# EAGLE schematic hackeeg-connector-24 (EAGLE 9.4.0)

## Sheet 1 of 3: HACKEEG 24 Position Connector Board
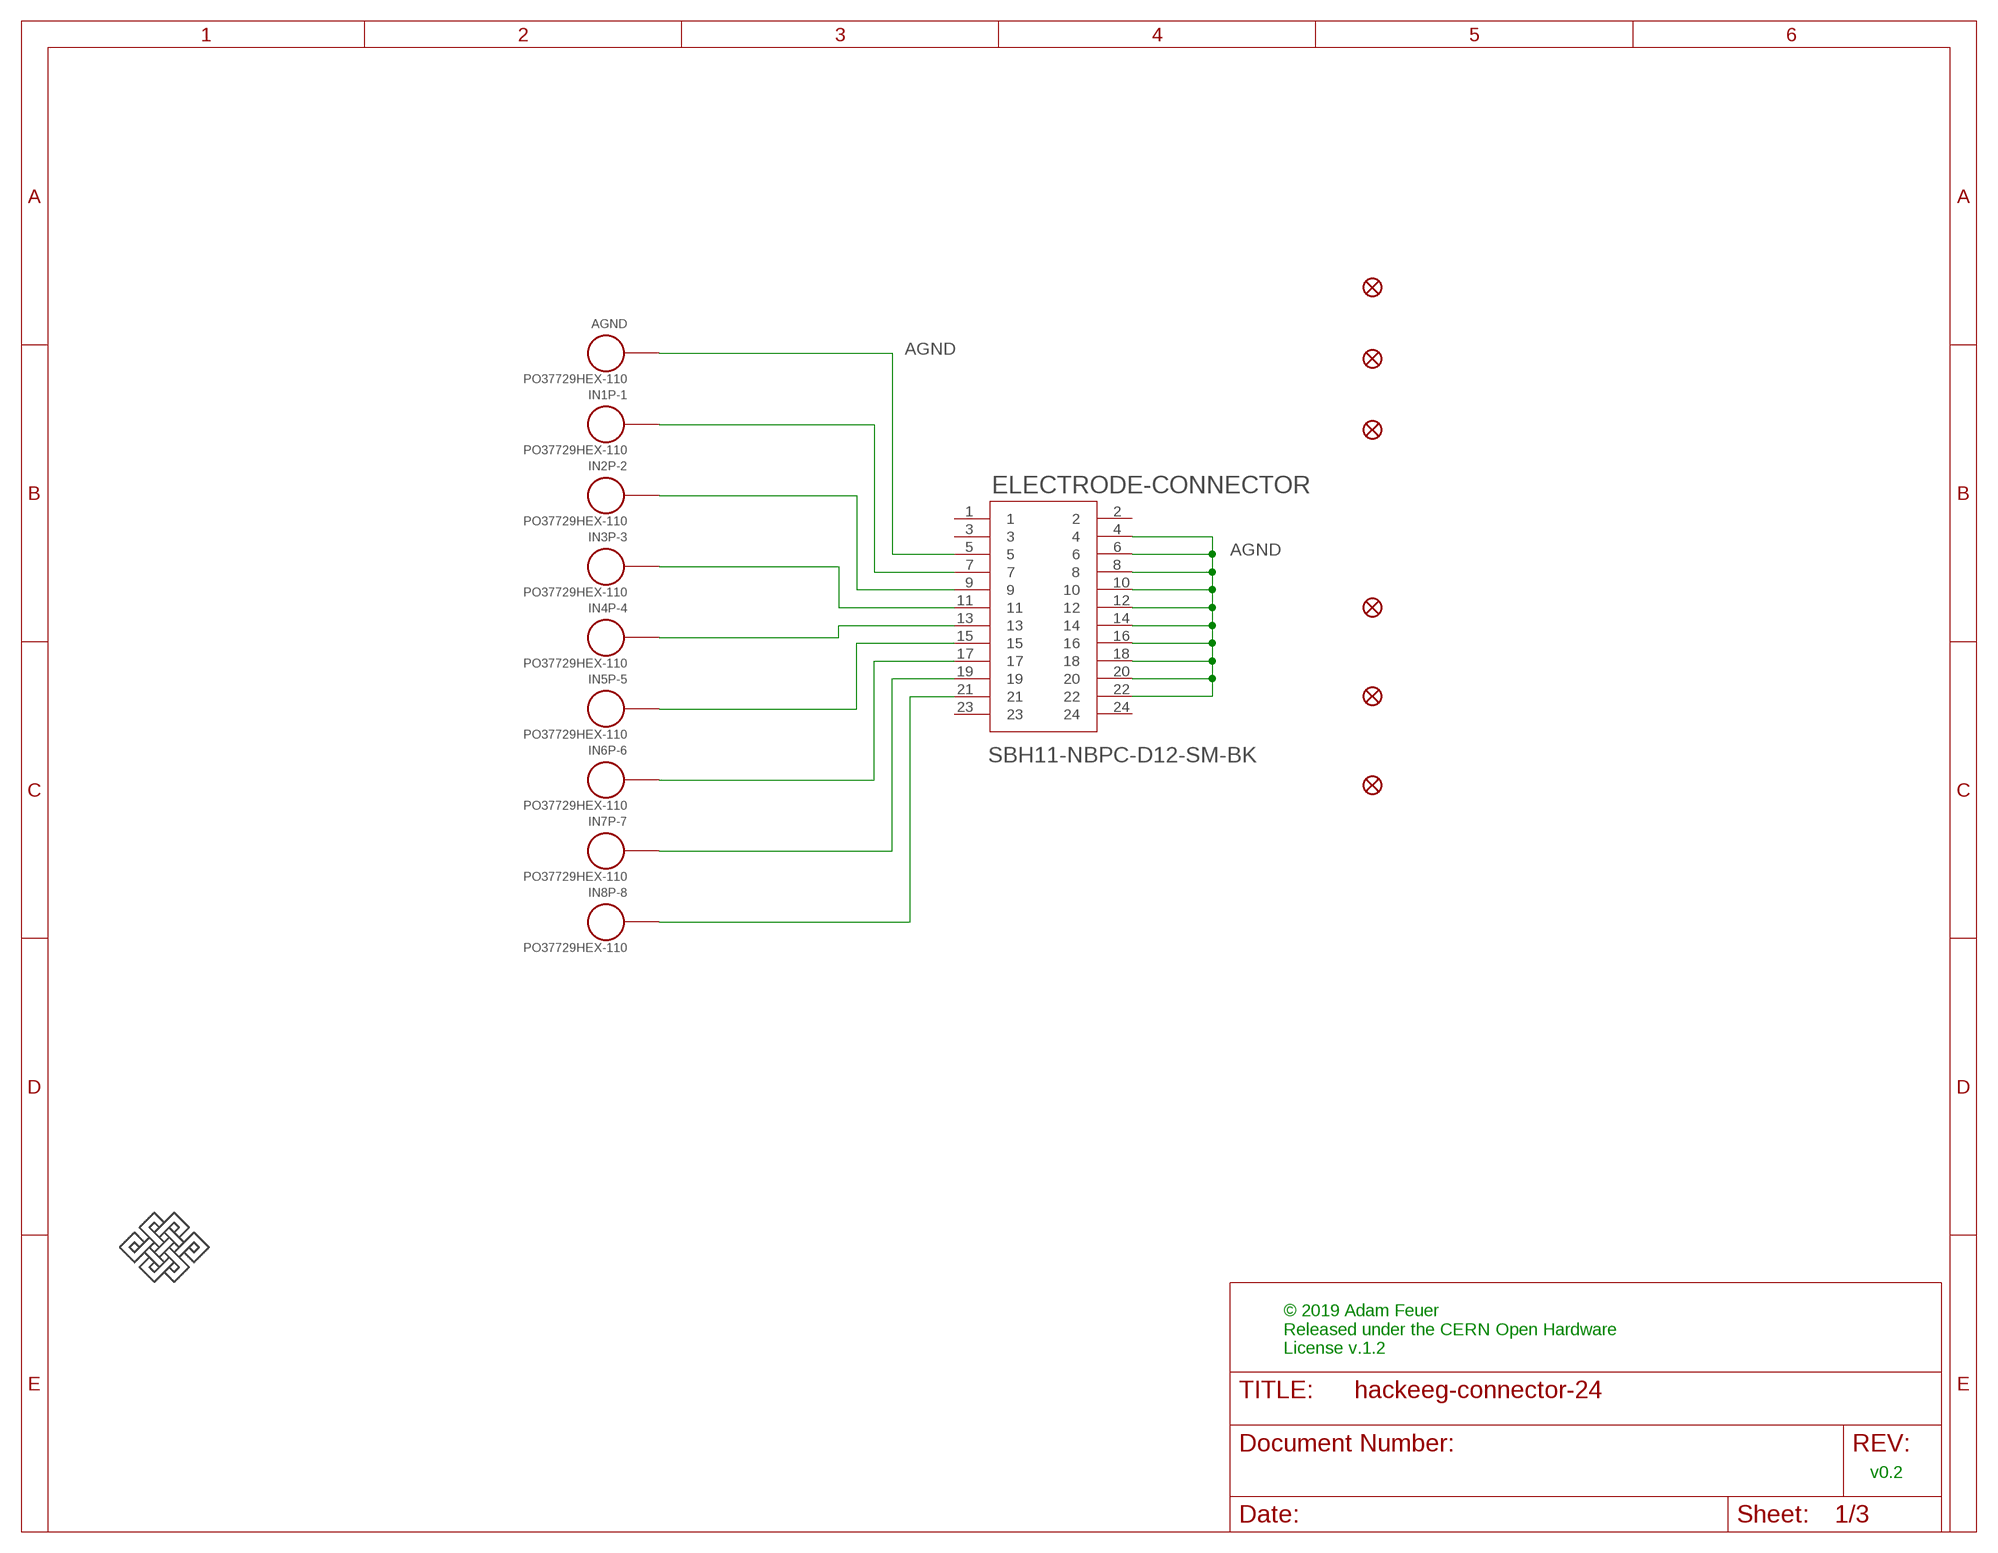
[diagram p0: schematic, sheet 1]

### Parts
AGND  PO37729HEX-110  [HEX-110]
ELECTRODE-CONNECTOR  SBH11-NBPC-D12-SM-BK  [SULLINS_SBH11-NBPC-D12-SM-BK]
FD1  FIDUCIAL1X2  [FIDUCIAL-1X2]
FD2  FIDUCIAL1X2  [FIDUCIAL-1X2]
FD3  FIDUCIAL1X2  [FIDUCIAL-1X2]
FD4  FIDUCIAL1X2  [FIDUCIAL-1X2]
FD5  FIDUCIAL1X2  [FIDUCIAL-1X2]
FD6  FIDUCIAL1X2  [FIDUCIAL-1X2]
IN1P-1  PO37729HEX-110  [HEX-110]
IN2P-2  PO37729HEX-110  [HEX-110]
IN3P-3  PO37729HEX-110  [HEX-110]
IN4P-4  PO37729HEX-110  [HEX-110]
IN5P-5  PO37729HEX-110  [HEX-110]
IN6P-6  PO37729HEX-110  [HEX-110]
IN7P-7  PO37729HEX-110  [HEX-110]
IN8P-8  PO37729HEX-110  [HEX-110]
U$1  ENDLESSKNOTENDLESSKNOT-MEDIUM  [ENDLESSKNOT-MEDIUM]

### Nets
AGND: AGND.SIGNAL ELECTRODE-CONNECTOR.4 ELECTRODE-CONNECTOR.5 ELECTRODE-CONNECTOR.6 ELECTRODE-CONNECTOR.8 ELECTRODE-CONNECTOR.10 ELECTRODE-CONNECTOR.12 ELECTRODE-CONNECTOR.14 ELECTRODE-CONNECTOR.16 ELECTRODE-CONNECTOR.18 ELECTRODE-CONNECTOR.20 ELECTRODE-CONNECTOR.22 ; also sheet 2,3
N$2: ELECTRODE-CONNECTOR.7 IN1P-1.SIGNAL
N$3: ELECTRODE-CONNECTOR.9 IN2P-2.SIGNAL
N$4: ELECTRODE-CONNECTOR.11 IN3P-3.SIGNAL
N$5: ELECTRODE-CONNECTOR.13 IN4P-4.SIGNAL
N$6: ELECTRODE-CONNECTOR.15 IN5P-5.SIGNAL
N$7: ELECTRODE-CONNECTOR.17 IN6P-6.SIGNAL
N$8: ELECTRODE-CONNECTOR.19 IN7P-7.SIGNAL
N$9: ELECTRODE-CONNECTOR.21 IN8P-8.SIGNAL
Unconnected: ELECTRODE-CONNECTOR.1 ELECTRODE-CONNECTOR.2 ELECTRODE-CONNECTOR.3 ELECTRODE-CONNECTOR.23 ELECTRODE-CONNECTOR.24

### Notes on the sheet
- © 2019 Adam Feuer
  Released under the CERN Open Hardware 
  License v.1.2
- v0.2

## Sheet 2 of 3
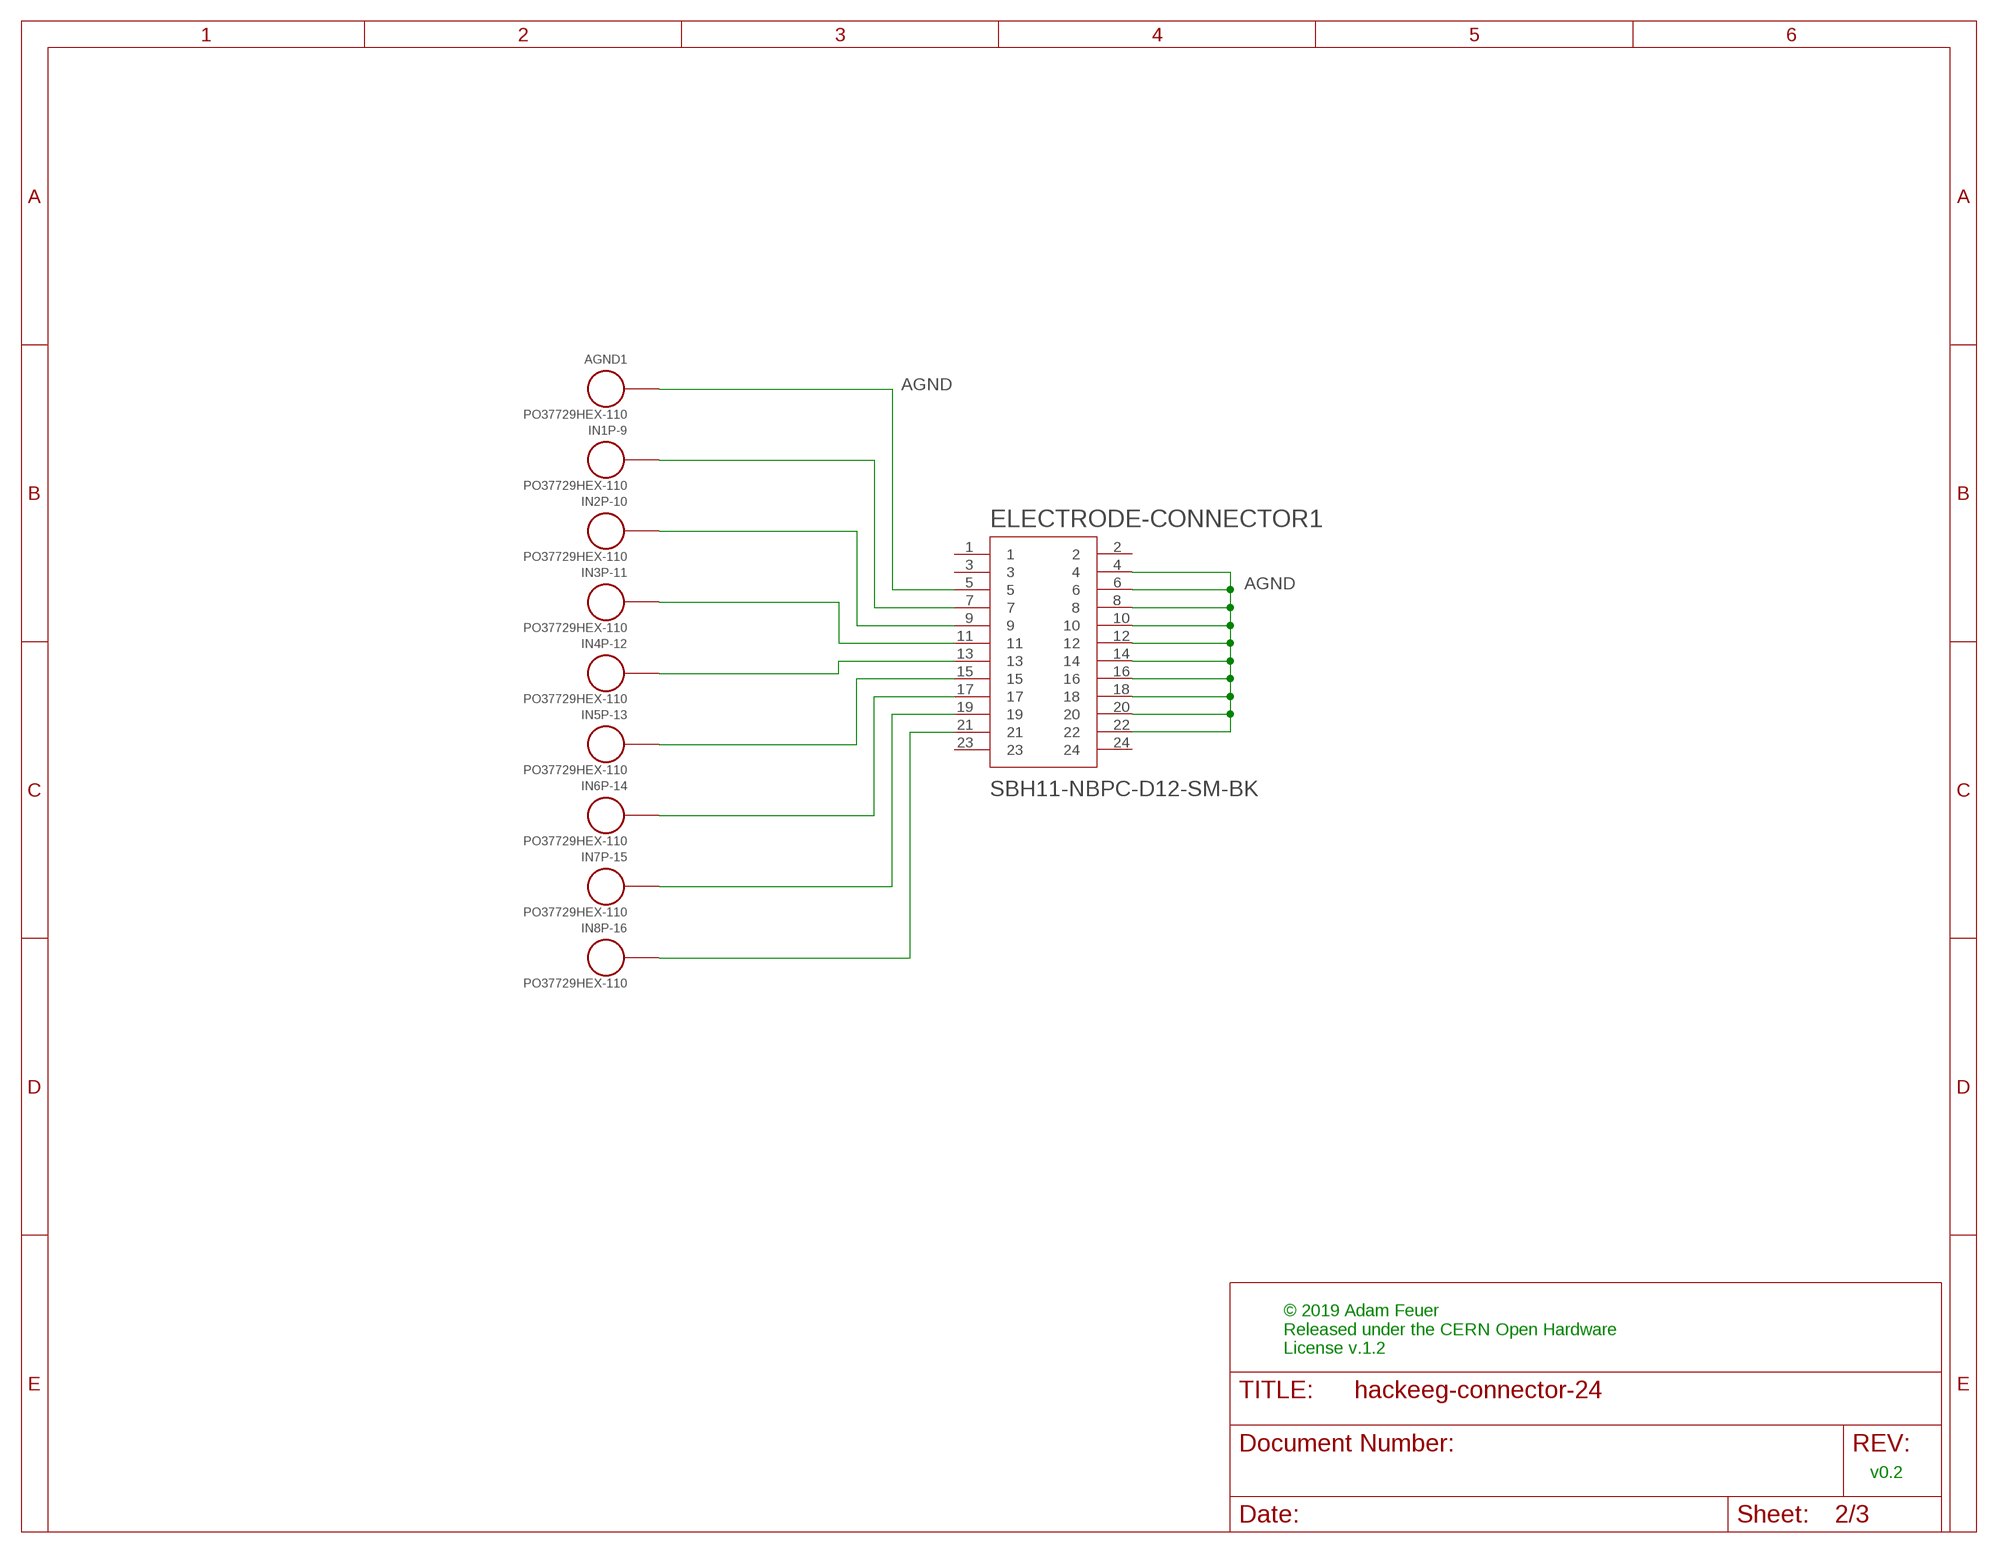
[diagram p1: schematic, sheet 2]

### Parts
AGND1  PO37729HEX-110  [HEX-110]
ELECTRODE-CONNECTOR1  SBH11-NBPC-D12-SM-BK  [SULLINS_SBH11-NBPC-D12-SM-BK]
IN1P-9  PO37729HEX-110  [HEX-110]
IN2P-10  PO37729HEX-110  [HEX-110]
IN3P-11  PO37729HEX-110  [HEX-110]
IN4P-12  PO37729HEX-110  [HEX-110]
IN5P-13  PO37729HEX-110  [HEX-110]
IN6P-14  PO37729HEX-110  [HEX-110]
IN7P-15  PO37729HEX-110  [HEX-110]
IN8P-16  PO37729HEX-110  [HEX-110]

### Nets
AGND: AGND1.SIGNAL ELECTRODE-CONNECTOR1.4 ELECTRODE-CONNECTOR1.5 ELECTRODE-CONNECTOR1.6 ELECTRODE-CONNECTOR1.8 ELECTRODE-CONNECTOR1.10 ELECTRODE-CONNECTOR1.12 ELECTRODE-CONNECTOR1.14 ELECTRODE-CONNECTOR1.16 ELECTRODE-CONNECTOR1.18 ELECTRODE-CONNECTOR1.20 ELECTRODE-CONNECTOR1.22 ; also sheet 1,3
N$11: ELECTRODE-CONNECTOR1.7 IN1P-9.SIGNAL
N$12: ELECTRODE-CONNECTOR1.9 IN2P-10.SIGNAL
N$13: ELECTRODE-CONNECTOR1.11 IN3P-11.SIGNAL
N$14: ELECTRODE-CONNECTOR1.13 IN4P-12.SIGNAL
N$15: ELECTRODE-CONNECTOR1.15 IN5P-13.SIGNAL
N$16: ELECTRODE-CONNECTOR1.17 IN6P-14.SIGNAL
N$17: ELECTRODE-CONNECTOR1.19 IN7P-15.SIGNAL
N$18: ELECTRODE-CONNECTOR1.21 IN8P-16.SIGNAL
Unconnected: ELECTRODE-CONNECTOR1.1 ELECTRODE-CONNECTOR1.2 ELECTRODE-CONNECTOR1.3 ELECTRODE-CONNECTOR1.23 ELECTRODE-CONNECTOR1.24

### Notes on the sheet
- © 2019 Adam Feuer
  Released under the CERN Open Hardware 
  License v.1.2
- v0.2

## Sheet 3 of 3
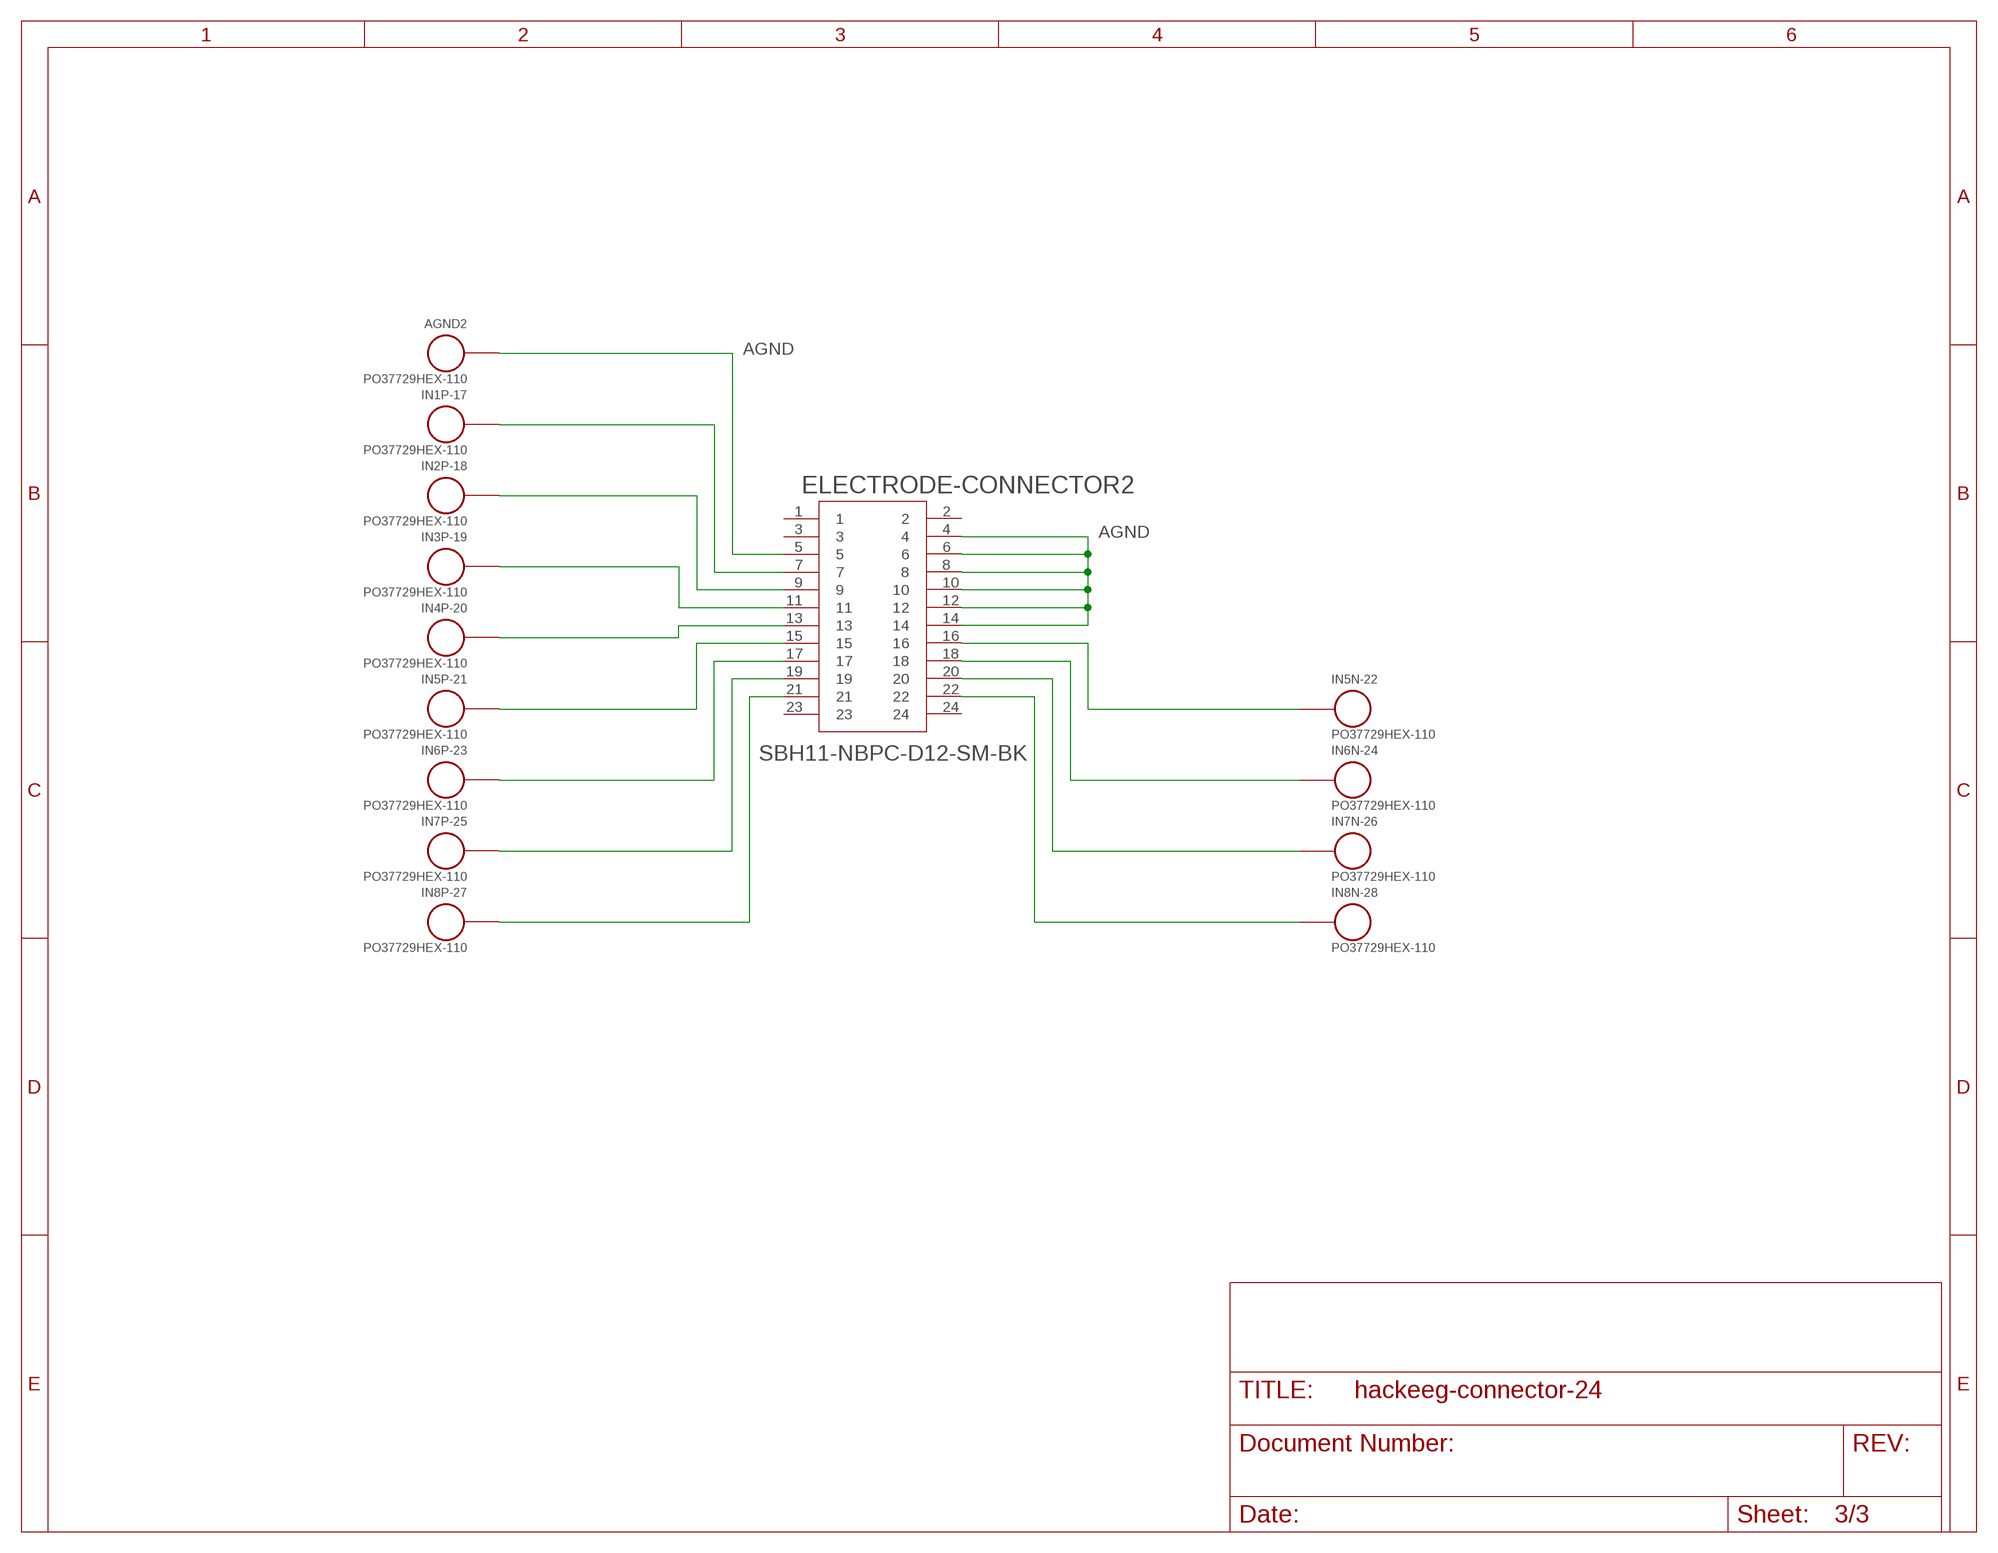
[diagram p2: schematic, sheet 3]

### Parts
AGND2  PO37729HEX-110  [HEX-110]
ELECTRODE-CONNECTOR2  SBH11-NBPC-D12-SM-BK  [SULLINS_SBH11-NBPC-D12-SM-BK]
IN1P-17  PO37729HEX-110  [HEX-110]
IN2P-18  PO37729HEX-110  [HEX-110]
IN3P-19  PO37729HEX-110  [HEX-110]
IN4P-20  PO37729HEX-110  [HEX-110]
IN5N-22  PO37729HEX-110  [HEX-110]
IN5P-21  PO37729HEX-110  [HEX-110]
IN6N-24  PO37729HEX-110  [HEX-110]
IN6P-23  PO37729HEX-110  [HEX-110]
IN7N-26  PO37729HEX-110  [HEX-110]
IN7P-25  PO37729HEX-110  [HEX-110]
IN8N-28  PO37729HEX-110  [HEX-110]
IN8P-27  PO37729HEX-110  [HEX-110]

### Nets
AGND: AGND2.SIGNAL ELECTRODE-CONNECTOR2.4 ELECTRODE-CONNECTOR2.5 ELECTRODE-CONNECTOR2.6 ELECTRODE-CONNECTOR2.8 ELECTRODE-CONNECTOR2.10 ELECTRODE-CONNECTOR2.12 ELECTRODE-CONNECTOR2.14 ; also sheet 1,2
N$20: ELECTRODE-CONNECTOR2.7 IN1P-17.SIGNAL
N$21: ELECTRODE-CONNECTOR2.9 IN2P-18.SIGNAL
N$22: ELECTRODE-CONNECTOR2.11 IN3P-19.SIGNAL
N$23: ELECTRODE-CONNECTOR2.13 IN4P-20.SIGNAL
N$24: ELECTRODE-CONNECTOR2.15 IN5P-21.SIGNAL
N$25: ELECTRODE-CONNECTOR2.17 IN6P-23.SIGNAL
N$26: ELECTRODE-CONNECTOR2.19 IN7P-25.SIGNAL
N$27: ELECTRODE-CONNECTOR2.21 IN8P-27.SIGNAL
N$28: ELECTRODE-CONNECTOR2.22 IN8N-28.SIGNAL
N$29: ELECTRODE-CONNECTOR2.20 IN7N-26.SIGNAL
N$30: ELECTRODE-CONNECTOR2.18 IN6N-24.SIGNAL
N$31: ELECTRODE-CONNECTOR2.16 IN5N-22.SIGNAL
Unconnected: ELECTRODE-CONNECTOR2.1 ELECTRODE-CONNECTOR2.2 ELECTRODE-CONNECTOR2.3 ELECTRODE-CONNECTOR2.23 ELECTRODE-CONNECTOR2.24

## Library data of the parts
AGND AGND1 AGND2 IN1P-1 IN1P-9 IN1P-17 IN2P-2 IN2P-10 IN2P-18 IN3P-3 IN3P-11 IN3P-19 IN4P-4 IN4P-12 IN4P-20 IN5N-22 IN5P-5 IN5P-13 IN5P-21 IN6N-24 IN6P-6 IN6P-14 IN6P-23 IN7N-26 IN7P-7 IN7P-15 IN7P-25 IN8N-28 IN8P-8 IN8P-16 IN8P-27 = po-37729:PO37729: Plastics One 37729 - DIN 42-802 female vertical jack
ELECTRODE-CONNECTOR ELECTRODE-CONNECTOR1 ELECTRODE-CONNECTOR2 = SBH11-NBPC-D12-SM-BK:SBH11-NBPC-D12-SM-BK: Conn Headr 2.54mm 24pos Gold Smd; AVAILABILITY: Warning; DESCRIPTION: Conn Headr 2.54mm 24pos Gold Smd; MF: Sullins Connector; MP: SBH11-NBPC-D12-SM-BK; PACKAGE: None; PRICE: 1.05 USD
FD1-FD6 = SparkFun-Aesthetics:FIDUCIAL: Fiducial Alignment Points Point-of-reference for pick-and-place machines and other optical instruments.
U$1 = endless-knot:ENDLESSKNOT